# EAGLE design midipal-v01 (EAGLE 5.09)
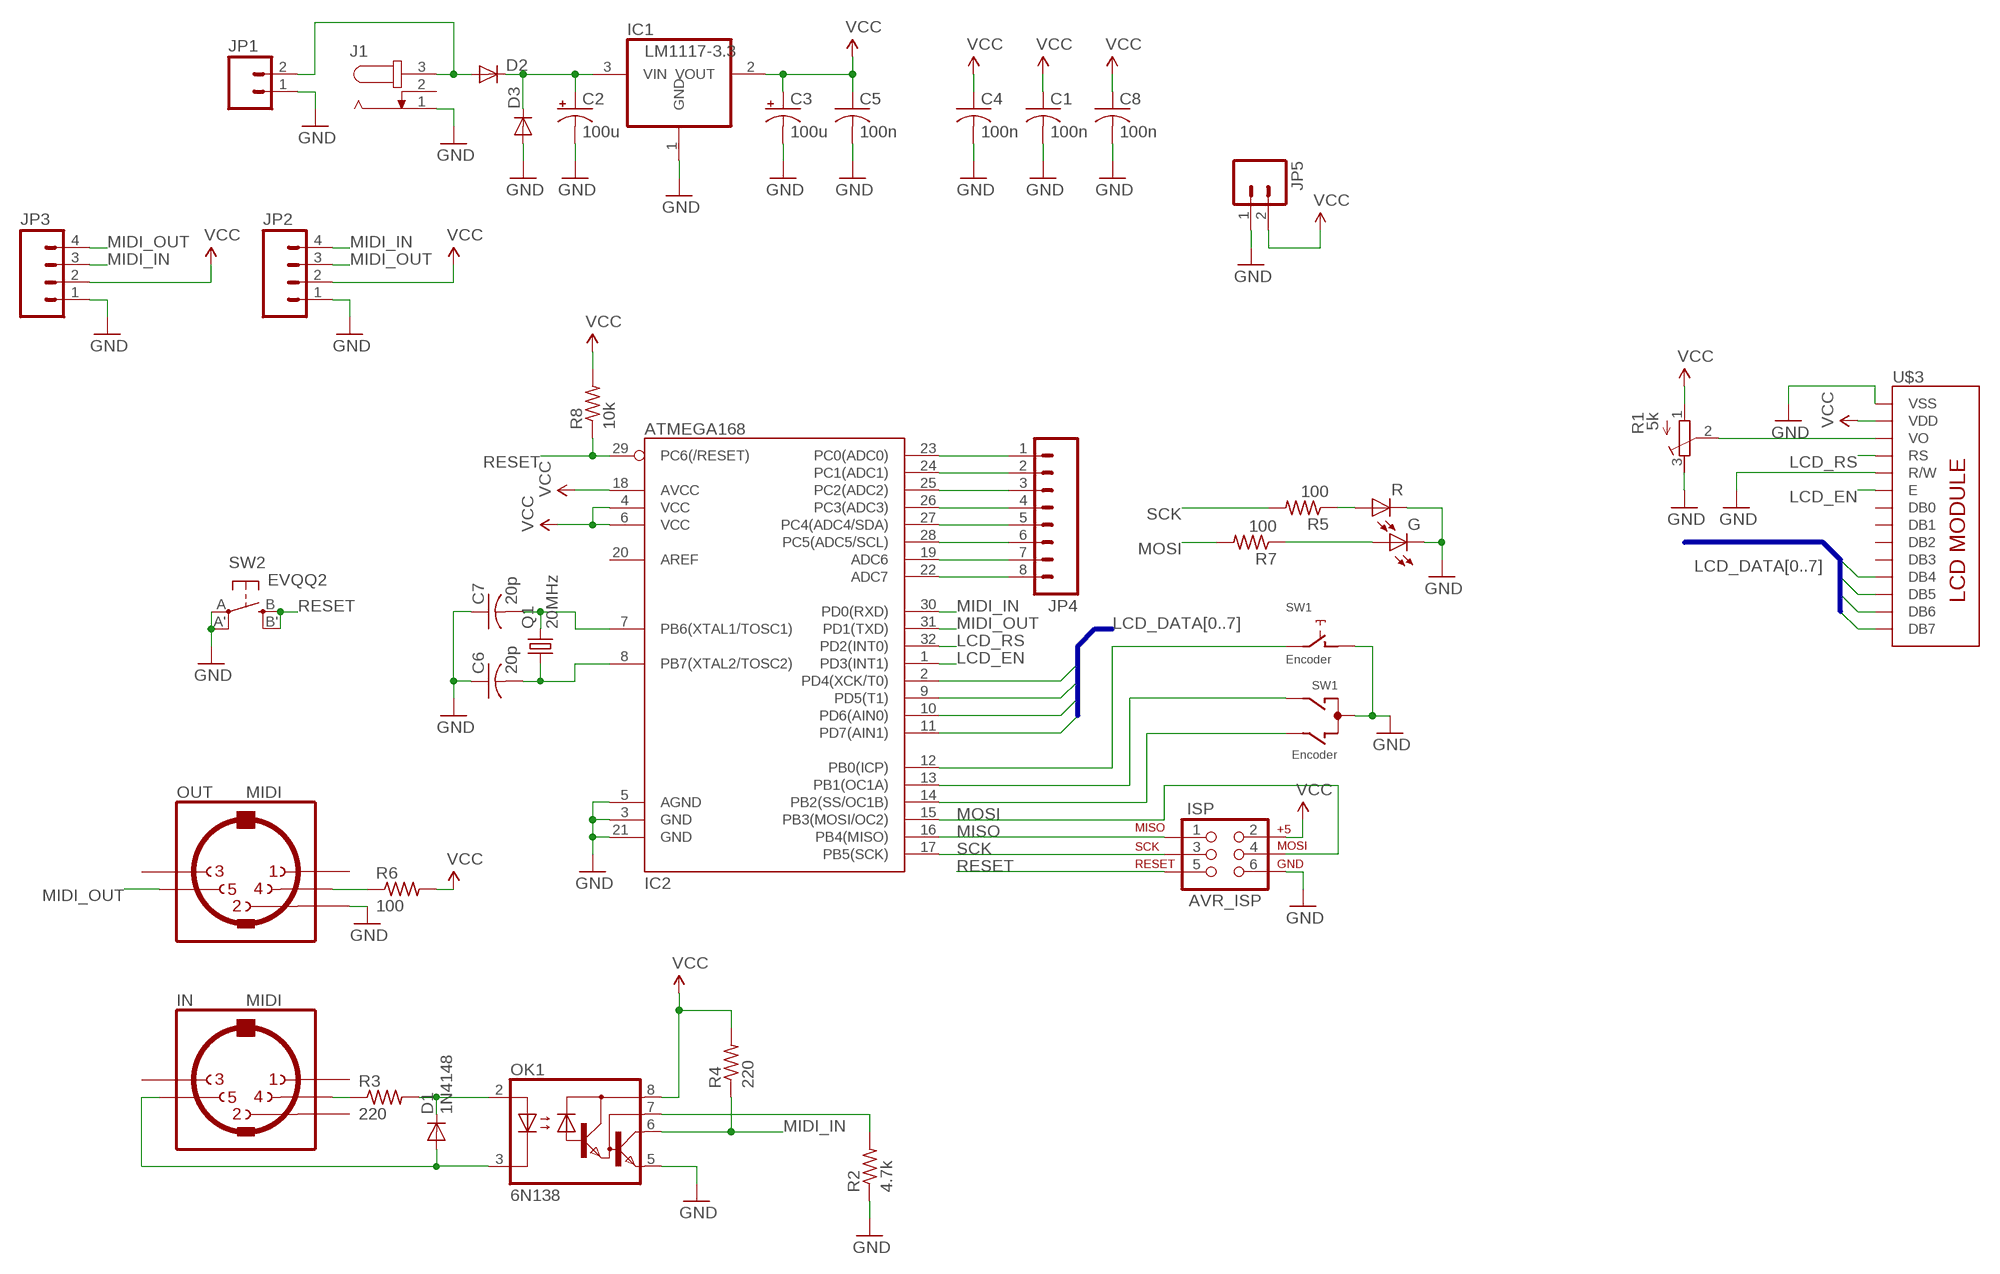
[diagram p0: schematic, sheet 1]

## Parts
C1  100n  C-USC0805  [C0805]
C2  100u  CPOL-USD  [PANASONIC_D]
C3  100u  CPOL-USD  [PANASONIC_D]
C4  100n  C-USC0805  [C0805]
C5  100n  C-USC0805  [C0805]
C6  20p  C-USC0805  [C0805]
C7  20p  C-USC0805  [C0805]
C8  100n  C-USC0805  [C0805]
D1  1N4148  DIODE-SOD323-W  [SOD323-W]
D2  DIODESMB  [SMB-DIODE]
D3  DIODESMB  [SMB-DIODE]
G  LEDCHIPLED_1206  [CHIPLED_1206]
IC1  LM1117-3.3  REG1117  [SOT223]
IC2  ATMEGA168  [TQFP32-08]
IN  MIDI  MAB5SH  [MAB5SH]
ISP  AVR_ISP  AVR_SPI_PRG_6PTH  [2X3]
J1  JACK-PLUG2  [SPC4078_BIG_HOLES]
JP1  M02  [1X02_LONGPADS]
JP2  M04PTH  [1X04]
JP3  M04PTH  [1X04]
JP4  M08  [1X08]
JP5  M02PTH  [1X02]
OK1  6N138  6N138SMD8  [DIL8-SMD]
OUT  MIDI  MAB5SH  [MAB5SH]
Q1  20MHz  CRYSTALHC49UP  [HC49UP]
R  LEDCHIPLED_1206  [CHIPLED_1206]
R1  5k  R-TRIMM3296P  [RTRIM3296P]
R2  4.7k  R-US_M0805  [M0805]
R3  220  R-US_M0805  [M0805]
R4  220  R-US_R0805  [R0805]
R5  100  R-US_R0805  [R0805]
R6  100  R-US_R0805  [R0805]
R7  100  R-US_R0805  [R0805]
R8  10k  R-US_R0805  [R0805]
SW1  Encoder  EC12E_SW  [ALPS_EC12E_SW]
SW2  EVQQ2  [EVQ-Q2]
U$3  LCD_MODULE_NO_BKL  [LCD_MODULE_1X8]

## Nets
GND: C1.2 C2.- C3.- C4.2 C5.2 C6.1 C7.1 C8.2 D3.A G.C IC1.1(GND) IC2.3(GND) IC2.5(AGND) IC2.21(GND) ISP.6 J1.1 JP1.1 JP2.1 JP3.1 JP5.1 OK1.5(GND) OUT.2 R1.3(A) R2.1 R.C SW1.C SW1.D SW2.A'(P1) SW2.A(P) U$3.1(VSS) U$3.5(R/W)
LCD_DATA4: IC2.2(PD4(XCK/T0)) U$3.11(DB4)
LCD_DATA5: IC2.9(PD5(T1)) U$3.12(DB5)
LCD_DATA6: IC2.10(PD6(AIN0)) U$3.13(DB6)
LCD_DATA7: IC2.11(PD7(AIN1)) U$3.14(DB7)
LCD_EN: IC2.1(PD3(INT1)) U$3.6(E)
LCD_RS: IC2.32(PD2(INT0)) U$3.4(RS)
MIDI_IN: IC2.30(PD0(RXD)) JP2.4 JP3.3 OK1.6(VO) R4.1
MIDI_OUT: IC2.31(PD1(TXD)) JP2.3 JP3.4 OUT.5
MISO: IC2.16(PB4(MISO)) ISP.1
MOSI: IC2.15(PB3(MOSI/OC2)) ISP.4 R7.2
N$2: C2.+ D2.C D3.C IC1.3(VIN)
N$3: IC2.23(PC0(ADC0)) JP4.1
N$5: IC2.24(PC1(ADC1)) JP4.2
N$6: IC2.25(PC2(ADC2)) JP4.3
N$7: IC2.26(PC3(ADC3)) JP4.4
N$8: IC2.27(PC4(ADC4/SDA)) JP4.5
N$9: IC2.28(PC5(ADC5/SCL)) JP4.6
N$10: IC2.19(ADC6) JP4.7
N$11: IC2.22(ADC7) JP4.8
N$12: G.A R7.1
N$13: OK1.7(VB) R2.2
N$14: R5.1 R.A
N$15: IC2.14(PB2(SS/OC1B)) SW1.B
N$16: IC2.13(PB1(OC1A)) SW1.A
N$17: IC2.12(PB0(ICP)) SW1.E
N$18: R1.2(S) U$3.3(VO)
N$28: D1.C OK1.2(A) R3.2
N$68: OUT.4 R6.1
N$72: IN.4 R3.1
N$73: D1.A IN.5 OK1.3(C)
N$82: C6.2 IC2.8(PB7(XTAL2/TOSC2)) Q1.1
N$83: C7.2 IC2.7(PB6(XTAL1/TOSC1)) Q1.2
RESET: IC2.29(PC6(/RESET)) ISP.5 R8.1 SW2.B'(S1) SW2.B(S)
SCK: IC2.17(PB5(SCK)) ISP.3 R5.2
VCC: C1.1 C3.+ C4.1 C5.1 C8.1 IC1.2(VOUT) IC2.4(VCC) IC2.6(VCC) IC2.18(AVCC) ISP.2 JP2.2 JP3.2 JP5.2 OK1.8(VCC) R1.1(E) R4.2 R6.2 R8.2 U$3.2(VDD)
VIN: D2.A J1.3 JP1.2
Unconnected: IC2.20(AREF) IN.1 IN.2 IN.3 J1.2 OUT.1 OUT.3 SW1.GND1(G) SW1.GND2(G) U$3.7(DB0) U$3.8(DB1) U$3.9(DB2) U$3.10(DB3)

## Buses
LCD_DATA[0..7]

## Library data of the parts
C1 C4-C8 = rcl:C-US: CAPACITOR, American symbol
C2 C3 = rcl:CPOL-US: POLARIZED CAPACITOR, American symbol
D1 = diode:DIODE-: DIODE
D2 D3 = SparkFun:DIODE: Diode These are standard reverse protection diodes and small signal diodes. SMA package can handle up to about 1A. SOD-323 can handle about 200mA. What the SOD-323 package when ordering, there are some mfgs out there that are 5-pin packages.
G R = led:LED: LED OSRAM: - CHIPLED LG R971, LG N971, LY N971, LG Q971, LY Q971, LO R971, LY R971 LH N974, LH R974 LS Q976, LO Q976, LY Q976 LO Q996 - Hyper CHIPLED LW Q18S LB Q993, LB Q99A, LB R99A - SideLED LS A670, LO A670, LY A670, LG A670, LP A670 LB A673, LV A673, LT A673, LW A673 LH A674 LY A675 LS A676, LA A676, LO A676, LY A676, LW A676 LS A679, LY A679, LG A679 - Hyper Micro SIDELED® LS Y876, LA Y876, LO Y876, LY Y876 LT Y87S - SmartLED LW L88C, LW L88S LB L89C, LB L89S, LG L890 LS L89K, LO L89K, LY L89K LS L896, LA L896, LO L896, LY L896 - TOPLED LS T670, LO T670, LY T670, LG T670, LP T670 LSG T670, LSP T670, LSY T670, LOP T670, LYG T670 LG T671, LOG T671, LSG T671 LB T673, LV T673, LT T673, LW T673 LH T674 LS T676, LA T676, LO T676, LY T676, LB T676, LH T676, LSB T676, LW T676 LB T67C, LV T67C, LT T67C, LS T67K, LO T67K, LY T67K, LW E67C LS E67B, LA E67B, LO E67B, LY E67B, LB E67C, LV E67C, LT E67C LW T67C LS T679, LY T679, LG T679 LS T770, LO T770, LY T770, LG T770, LP T770 LB T773, LV T773, LT T773, LW T773 LH T774 LS E675, LA E675, LY E675, LS T675 LS T776, LA T776, LO T776, LY T776, LB T776 LHGB T686 LT T68C, LB T68C - Hyper Mini TOPLED® LB M676 - Mini TOPLED Santana® LG M470 LS M47K, LO M47K, LY M47K Source: http://www.osram.convergy.de LUXEON: - LUMILED® LXK2-PW12-R00, LXK2-PW12-S00, LXK2-PW14-U00, LXK2-PW14-V00 LXK2-PM12-R00, LXK2-PM12-S00, LXK2-PM14-U00 LXK2-PE12-Q00, LXK2-PE12-R00, LXK2-PE12-S00, LXK2-PE14-T00, LXK2-PE14-U00 LXK2-PB12-K00, LXK2-PB12-L00, LXK2-PB12-M00, LXK2-PB14-N00, LXK2-PB14-P00, LXK2-PB14-Q00 LXK2-PR12-L00, LXK2-PR12-M00, LXK2-PR14-Q00, LXK2-PR14-R00 LXK2-PD12-Q00, LXK2-PD12-R00, LXK2-PD12-S00 LXK2-PH12-R00, LXK2-PH12-S00 LXK2-PL12-P00, LXK2-PL12-Q00, LXK2-PL12-R00 Source: www.luxeon.com KINGBRIGHT: KA-3528ASYC Source: www.kingbright.com
IC1 = burr-brown:REG1117: 800mA and 1A Low Dropout (LDO) Positive Regulator 1.8V, 2.5V, 2.85V, 3.3V, 5V, and Adj
IC2 = SparkFun:ATMEGA168
IN OUT = og-midi:MAB5SH: Female CONNECTOR 5 pins 90 deg. with shield, horizontal (DIN 41524)
ISP = SparkFun:AVR_SPI_PRG_6: AVR ISP 6 Pin This is the reduced ISP connector for AVR programming. Common on Arduino. This footprint will take up less PCB space and can be used with a 10-pin to 6-pin adapter such as SKU: BOB-08508
J1 = con-jack2:JACK-PLUG: DC POWER JACK Power Jack, DC, Right Angle, Through Hole, Rated 5A at 16VDC, PC Terminals Distributor: Farnell (www.Farnell.de) Drawing: 84N1161.pdf / 84N1162.pdf Manufacturer: SPC Technology (www.spctechnology.com) Type: SPC4077 / SPC 4078
JP1 JP5 = SparkFun:M02: Header 2 Standard 2-pin 0.1" header. Use with straight break away headers (SKU : PRT-00116), right angle break away headers (PRT-00553), swiss pins (PRT-00743), machine pins (PRT-00117), and female headers (PRT-00115). Molex polarized connector foot print use with SKU : PRT-08233 with associated crimp pins and housings.
JP2 JP3 = SparkFun:M04: Header 4 Standard 4-pin 0.1" header. Use with straight break away headers (SKU : PRT-00116), right angle break away headers (PRT-00553), swiss pins (PRT-00743), machine pins (PRT-00117), and female headers (PRT-00115). Molex polarized connector foot print use with SKU : PRT-08231 with associated crimp pins and housings.
JP4 = SparkFun:M08: Header 8 Standard 8-pin 0.1" header. Use with straight break away headers (SKU : PRT-00116), right angle break away headers (PRT-00553), swiss pins (PRT-00743), machine pins (PRT-00117), and female headers (PRT-00115).
OK1 = og-optocouplers:6N138: MOTOROLA OPTO COUPLER
Q1 = crystal:CRYSTAL: CRYSTAL
R1 = rcl:R-TRIMM: Trimm resistor
R2-R8 = rcl:R-US_: RESISTOR, American symbol
SW1 = switch-alps:EC12E_SW: ALPS rotary Encoder EC12E series with switch
SW2 = adafruit:EVQQ2: SMT 6mm switch, EVQQ2 series http://www.ladyada.net/library/eagle
U$3 = og-lcd:LCD_MODULE_NO_BKL

## Board
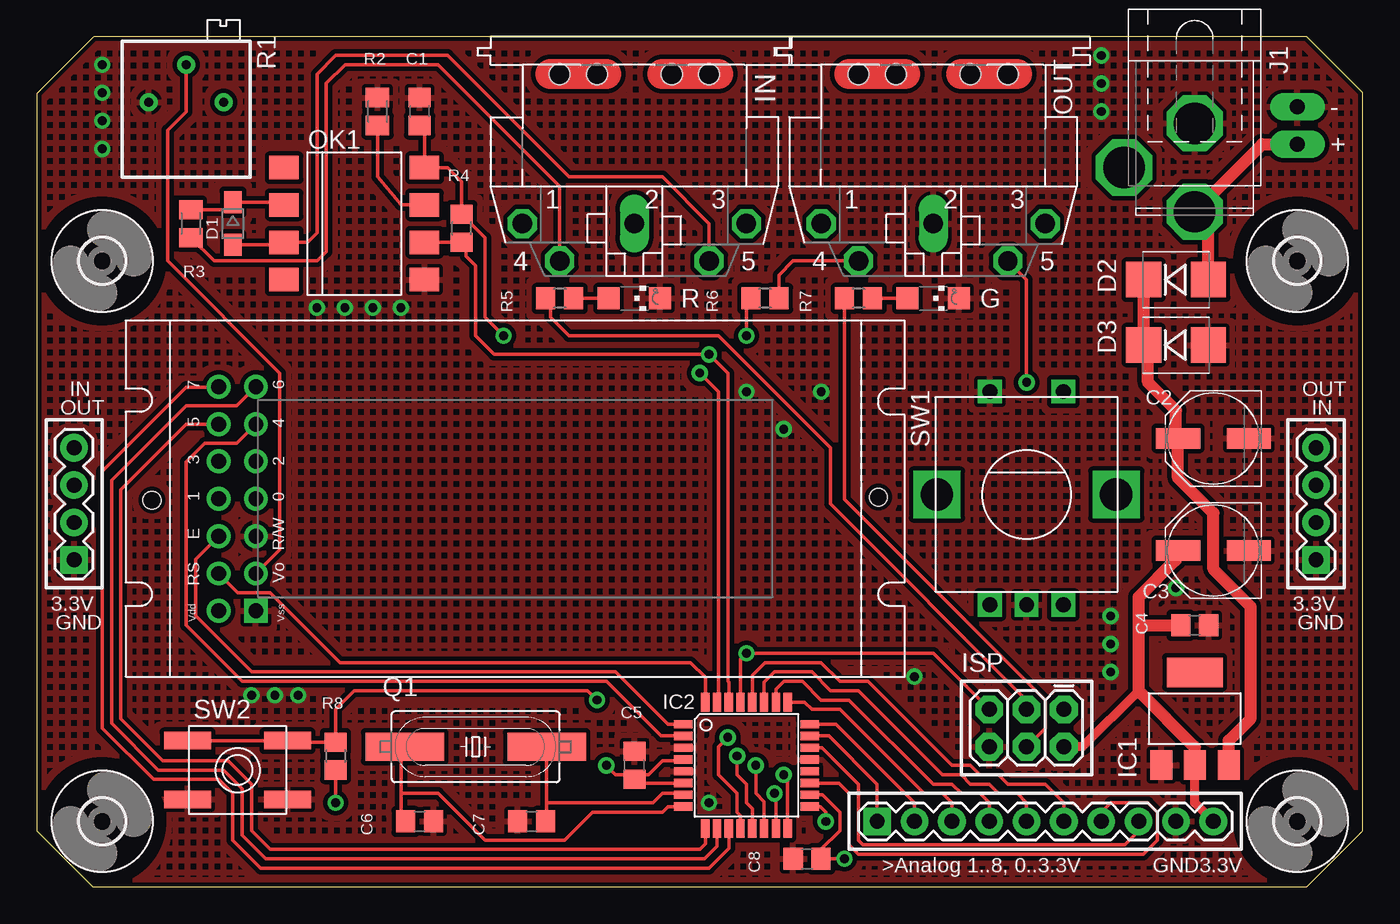
[diagram p1: board, top side]
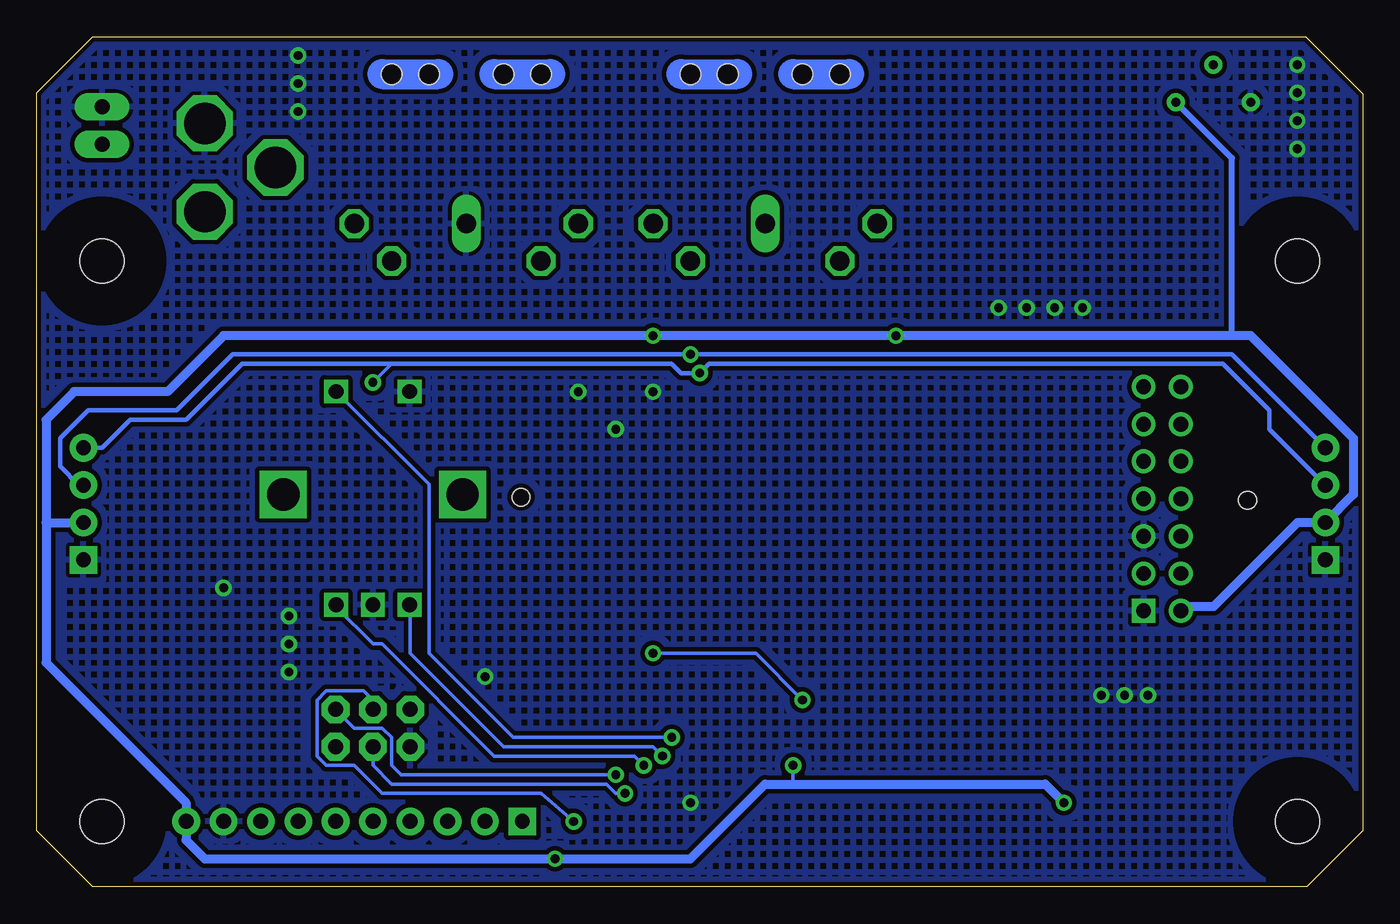
[diagram p2: board, bottom side, seen from below]

Size 90.17 x 57.79 mm. Coordinates in mm from the lower left corner, seen from the top.
Outline: 90.17,53.98 86.36,57.79 3.89,57.79 0,53.9 0,3.81 3.81,0 86.36,0 90.17,3.81 90.17,53.98
Copper layers (1*16): Top 0.035mm / dielectric 1.5mm / Bottom 0.035mm
Design rules "SparkFun": minimum track width 8mil, minimum drill 20mil, track to track 8mil, track to pad 8mil, pad to pad 8mil, via to via 8mil, smd to smd 8mil, copper to edge 10mil, drill to drill 8mil, minimum pad ring 12mil, minimum via ring 10mil, stop-mask expansion 4mil, vias tented up to drill 25mil, thermal gap 10mil

### Footprints (pad centres in the part's own frame; a part is rotated, then mirrored left to right if it is on the bottom)
C0805 = smd 1.3 x 1.5: 1 -0.95,0; 2 0.95,0
PANASONIC_D = smd 3 x 1.4: + 2.4,0; - -2.4,0
SOD323-W = smd 1.5 x 1.2: A 1.45,0; C -1.45,0
SMB-DIODE = smd 2.4 x 2.4: A 2.2,0; C -2.2,0
CHIPLED_1206 = smd 1.5 x 1.5: A 0,-1.75; C 0,1.75
SOT223 = smd 1.499 x 2.007: 1 -2.261,-3.15; 2 0.025,-3.15; 3 2.311,-3.15 | smd 3.81 x 2.007: 4 0,3.15
TQFP32-08 = smd 1.27 x 0.559: 1 -4.293,2.8; 2 -4.293,2; 3 -4.293,1.2; 4 -4.293,0.4; 5 -4.293,-0.4; 6 -4.293,-1.2; 7 -4.293,-2; 8 -4.293,-2.8; 17 4.293,-2.8; 18 4.293,-2; 19 4.293,-1.2; 20 4.293,-0.4; 21 4.293,0.4; 22 4.293,1.2; 23 4.293,2; 24 4.293,2.8 | smd 0.559 x 1.27: 9 -2.8,-4.293; 10 -2,-4.293; 11 -1.2,-4.293; 12 -0.4,-4.293; 13 0.4,-4.293; 14 1.2,-4.293; 15 2,-4.293; 16 2.8,-4.293; 25 2.8,4.293; 26 2,4.293; 27 1.2,4.293; 28 0.4,4.293; 29 -0.4,4.293; 30 -1.2,4.293; 31 -2,4.293; 32 -2.8,4.293
MAB5SH = drill 1.321 octagon: 1 7.62,7.62; 3 -7.62,7.62; 4 5.08,10.16; 5 -5.08,10.16 | drill 1.321 long: 2 0,7.62 | hole 1.4: 2.54,-2.54; -2.54,-2.54; -5.08,-2.54; 5.08,-2.54
2X3 = drill 1.016 pad 1.88 octagon: 1 0,0; 2 0,2.54; 3 2.54,0; 4 2.54,2.54; 5 5.08,0; 6 5.08,2.54
SPC4078_BIG_HOLES = drill 2.8 pad 3.81 octagon: 1 -0.46,0; 2 2.54,-4.8; 3 5.54,0
1X02_LONGPADS = drill 1.016 pad 1.88 long: 1 0,0; 2 2.54,0
1X04 = drill 1.016 pad 1.88 square: 1 0,0 | drill 1.016 pad 1.88 round: 2 2.54,0; 3 5.08,0; 4 7.62,0
1X08 = drill 1.016 pad 1.88 square: 1 0,0 | drill 1.016 pad 1.88 round: 2 2.54,0; 3 5.08,0; 4 7.62,0; 5 10.16,0; 6 12.7,0; 7 15.24,0; 8 17.78,0
1X02 = drill 1.016 pad 1.88 round: 1 0,0; 2 2.54,0
DIL8-SMD = smd 1.6 x 2: 1 -3.81,-4.77; 2 -1.27,-4.77; 3 1.27,-4.77; 4 3.81,-4.77; 5 3.81,4.77; 6 1.27,4.77; 7 -1.27,4.77; 8 -3.81,4.77
HC49UP = smd 5.334 x 1.93: 1 -4.826,0; 2 4.826,0
RTRIM3296P = drill 0.61 round: 1 0,-2.54; 2 2.54,0; 3 0,2.54
M0805 = smd 1.3 x 1.6: 1 -0.95,0; 2 0.95,0
R0805 = smd 1.3 x 1.5: 1 -0.95,0; 2 0.95,0
ALPS_EC12E_SW = drill 1 square: A -2.5,-7.5; B 2.5,-7.5; C 0,-7.5; D -2.5,7; E 2.5,7 | drill 2.2 square: GND1 -6.1,0; GND2 6.1,0
EVQ-Q2 = smd 3.2 x 1.2: A -3.4,-2; A' 3.4,-2; B -3.4,2; B' 3.4,2
3,0 = hole 3: 0,0
LCD_MODULE_1X8 = drill 1.016 square: 1 8.87,4.47 | drill 1.016 round: 2 6.33,4.47; 3 8.87,7.01; 4 6.33,7.01; 5 8.87,9.55; 6 6.33,9.55; 7 8.87,12.09; 8 6.33,12.09; 9 8.87,14.63; 10 6.33,14.63; 11 8.87,17.17; 12 6.33,17.17; 13 8.87,19.71; 14 6.33,19.71 | hole 1.2: 1.8,12; 51.2,12.2

### Placement (x,y rotation side)
C1  26.04,52.71 90 top
C2  80.01,30.48 180 top
C3  80.01,22.86 180 top
C4  78.74,17.78 0 top
C5  40.64,8.26 90 top
C6  26.04,4.45 180 top
C7  33.66,4.45 0 top
C8  52.39,1.91 180 top
D1  13.34,45.09 270 top
D2  77.47,41.27 0 top
D3  77.47,36.83 0 top
G  60.96,40.01 270 top
IC1  78.74,11.43 0 top
IC2  48.26,8.26 0 top
IN  40.64,52.71 180 top
ISP  69.85,12.06 180 top
J1  78.74,51.44 270 top
JP1  85.72,53.02 270 top
JP2  2.54,22.22 90 top
JP3  87,22.22 90 top
JP4  57.15,4.45 0 top
JP5  77.47,4.45 0 top
OK1  21.59,45.09 270 top
OUT  60.96,52.71 180 top
Q1  29.85,9.53 0 top
R  40.64,40.01 270 top
R1  10.16,53.34 90 top
R2  23.18,52.71 270 top
R3  10.48,45.09 90 top
R4  28.89,44.77 90 top
R5  35.56,40.01 180 top
R6  49.53,40.01 180 top
R7  55.88,40.01 180 top
R8  20.32,8.89 270 top
SW1  67.31,26.67 0 top
SW2  13.65,7.94 0 top
U$1  [3,0]  4.45,42.55 0 top
U$2  [3,0]  85.72,42.55 0 top
U$3  6.03,14.29 0 top
U$4  [3,0]  4.45,4.45 0 top
U$5  [3,0]  85.72,4.45 0 top

### Tracks (layer width: path | path; a pad name or v marks a point on that pad's centre or on a via)
GND  (via drill 0.6)
  other vias: 77.47,20.32 45.72,5.71 59.69,14.29 73.03,18.41 73.03,16.51 73.03,14.61 4.45,55.88 4.45,53.98 4.45,52.07 4.45,50.16 72.39,56.52 72.39,54.61 72.39,52.71 14.61,13.02 16.19,13.02 17.78,13.02 53.34,33.66 48.26,33.66 50.8,31.11 20.96,39.37 22.86,39.37 19.05,39.37 24.77,39.37
  pour Top (isolate 0.305, hatched): -1.27,59.05 -1.27,-0.64 91.44,-0.64 91.44,59.05
  pour Bottom (isolate 0.305, hatched): -1.27,-0.64 91.44,-0.64 91.44,59.05 -1.27,59.05
LCD_DATA4
  Top 0.254: U$3.11 13.61,30.16 11.43,30.16 10.16,28.89 10.16,17.78 13.97,13.97 38.73,13.97 42.45,10.26 IC2.2
LCD_DATA5
  Top 0.254: U$3.12 12.34,31.43 10.16,31.43 5.72,26.99 5.72,11.43 8.57,8.57 13.02,8.57 14.61,6.99 14.61,3.81 15.88,2.54 45.09,2.54 45.46,2.92 IC2.9
LCD_DATA6
  Top 0.254: U$3.13 13.61,32.7 10.16,32.7 5.08,27.62 5.08,11.11 8.26,7.94 12.7,7.94 13.97,6.67 13.97,3.49 15.56,1.91 45.4,1.91 46.26,2.76 IC2.10
LCD_DATA7
  Top 0.254: U$3.14 11.7,33.97 10.16,33.97 4.45,28.26 4.45,10.79 7.94,7.3 12.38,7.3 13.34,6.35 13.34,3.17 15.24,1.27 45.72,1.27 47.06,2.61 IC2.11
LCD_EN
  Top 0.254: U$3.6 10.8,22.27 10.8,18.41 14.61,14.61 39.37,14.61 42.92,11.05 IC2.1
LCD_RS
  Top 0.254: U$3.4 13.66,20 15.88,20 20.64,15.24 44.45,15.24 45.46,14.23 IC2.32
MIDI_IN  (via drill 0.6)
  Top 0.254: OK1.6 R4.1 | R4.1 | R4.1 29.21,43.5 29.21,42.86 29.85,42.23 29.85,37.47 31.12,36.2 v45.72,36.2 46.99,34.93 46.99,13.97 47.06,13.9 IC2.30
  Bottom 0.305: JP2.4 8.89,36.2 v45.72,36.2 76.84,36.2 80.65,32.39 86.68,32.39 88.58,30.48 88.58,28.57 87.31,27.3 JP3.3
MIDI_OUT  (via drill 0.6)
  Top 0.254: IC2.31 46.36,12.64 46.36,33.66 v45.09,34.93 | v67.31,34.29 67.31,41.27 OUT.5
  Bottom 0.254: 66.04,35.56 v67.31,34.29
  Bottom 0.305: JP2.3 6.35,31.11 6.35,32.39 9.53,35.56 44.45,35.56 v45.09,34.93 46.36,34.93 46.99,35.56 66.04,35.56 76.2,35.56 80.01,31.75 83.82,31.75 85.72,29.84 JP3.4
MISO  (via drill 0.6)
  Top 0.254: v50.8,7.62 51.06,7.36 IC2.16
  Bottom 0.254: ISP.1 68.58,10.79 66.68,10.79 66.04,10.16 66.04,8.26 65.41,7.62 v50.8,7.62
MOSI  (via drill 0.6)
  Top 0.254: ISP.4 68.58,10.79 68.58,12.7 54.93,26.35 54.93,38.41 R7.2 | v50.17,6.35 50.26,6.25 IC2.15
  Bottom 0.254: ISP.4 67.31,8.26 66.04,6.99 51.44,6.99 50.8,6.35 v50.17,6.35
N$2
  Top 0.813: IC1.3 81.05,9.93 82.55,11.43 82.55,19.05 80.01,21.59 80.01,25.4 77.61,27.8 C2.+ 77.47,30.62 77.47,32.39 75.56,34.29 75.56,36.54 D3.C D2.C
N$3
  Top 0.254: JP4.1 57.15,6.99 53.88,10.26 IC2.23
N$5
  Top 0.254: JP4.2 59.69,5.71 54.35,11.05 IC2.24
N$6
  Top 0.254: JP4.3 62.23,5.71 61.59,6.35 60.33,6.35 54.61,12.06 52.7,12.06 52.22,12.55 IC2.25
N$7
  Top 0.254: JP4.4 64.77,5.71 64.14,6.35 62.87,6.35 62.23,6.99 60.96,6.99 55.25,12.7 53.34,12.7 52.07,13.97 50.8,13.97 50.26,13.43 IC2.26
N$8
  Top 0.254: JP4.5 67.31,5.71 66.68,6.35 65.41,6.35 64.77,6.99 63.5,6.99 62.87,7.62 61.59,7.62 55.88,13.34 53.98,13.34 52.7,14.61 50.17,14.61 49.46,13.9 IC2.27
N$9
  Top 0.254: JP4.6 69.85,5.71 68.58,6.99 66.04,6.99 65.41,7.62 64.14,7.62 63.5,8.26 62.23,8.26 56.52,13.97 54.61,13.97 53.34,15.24 49.53,15.24 48.66,14.37 IC2.28
N$10
  Top 0.254: JP4.7 72.39,5.08 73.03,5.71 75.56,5.71 76.2,5.08 76.2,3.17 75.25,2.22 55.88,2.22 55.25,2.86 55.25,6.35 54.54,7.06 IC2.19
N$11
  Top 0.254: JP4.8 74.93,3.81 73.98,2.86 56.2,2.86 55.88,3.17 55.88,6.99 53.41,9.46 IC2.22
N$12
  Top 0.254: R7.1 G.A
N$13
  Top 0.254: R2.2 23.18,48.26 24.77,46.36 OK1.7
N$14
  Top 0.254: R5.1 R.A
N$15  (via drill 0.6)
  Top 0.254: v48.9,8.26 48.9,6.35 49.46,5.79 IC2.14
  Bottom 0.254: SW1.B 69.85,19.21 69.85,19.05 67.31,16.51 66.68,16.51 59.06,8.89 49.53,8.89 v48.9,8.26
N$16  (via drill 0.6)
  Top 0.254: v47.62,8.89 47.62,7.62 48.26,6.99 48.26,5.71 48.66,5.32 IC2.13
  Bottom 0.254: SW1.A 64.77,18.49 64.77,15.88 58.42,9.53 48.26,9.53 v47.62,8.89
N$17  (via drill 0.6)
  Top 0.254: v46.99,10.16 46.36,9.53 46.36,7.62 47.62,6.35 47.62,5.08 47.86,4.85 IC2.12
  Bottom 0.254: SW1.E 63.5,27.36 63.5,15.88 57.79,10.16 v46.99,10.16
N$18
  Top 0.254: U$3.3 16.51,22.9 16.51,34.93 8.89,42.55 8.89,51.44 10.16,52.71 R1.2
N$28
  Top 0.254: OK1.2 16.64,46.54 D1.C 12.84,46.04 R3.2
N$68
  Top 0.254: OUT.4 51.44,42.55 50.48,41.59 R6.1
N$72
  Top 0.254: IN.4 35.56,47.62 27.31,55.88 20.96,55.88 19.69,54.61 19.69,43.18 19.05,42.55 12.07,42.55 R3.1
N$73
  Top 0.254: D1.A 16.64,43.64 OK1.3 18.42,43.82 19.05,44.45 19.05,55.25 20.32,56.52 27.94,56.52 36.2,48.26 42.55,48.26 45.72,45.09 IN.5
N$82
  Top 0.254: Q1.1 25.09,9.46 24.77,9.14 24.77,6.35 | 24.77,6.35 27.31,6.35 30.48,3.17 35.88,3.17 37.78,5.08 42.55,5.08 42.92,5.46 IC2.8 | 24.77,6.35 24.77,5.08 25.09,4.76 C6.2
N$83
  Top 0.254: C7.2 34.67,4.51 34.67,5.71 | 34.67,5.71 Q1.2 | IC2.7 43.87,6.35 42.55,6.35 41.91,5.71 34.67,5.71
RESET  (via drill 0.6)
  Top 0.254: SW2.B SW2.B' 15.88,9.84 R8.1 20.32,12.06 21.59,13.34 37.47,13.34 v38.1,12.7 | ISP.5 60.96,15.88 v48.26,15.88 47.86,15.47 IC2.29
  Bottom 0.254: v38.1,12.7 41.28,15.88 v48.26,15.88
SCK  (via drill 0.6)
  Top 0.254: R5.2 34.93,39.69 34.93,38.73 36.2,37.47 46.36,37.47 53.98,29.84 53.98,26.04 67.31,12.7 ISP.3 | v53.66,4.45 53.66,5.08 53.28,5.46 IC2.17
  Bottom 0.254: ISP.3 67.31,12.7 67.94,13.34 70.49,13.34 71.12,12.7 71.12,8.89 70.49,8.26 68.58,8.26 66.68,6.35 55.88,6.35 v53.66,4.45
VCC  (via drill 0.6)
  Top 0.254: C1.1 26.36,51.76 OK1.8 27.94,48.9 28.89,47.94 R4.2 30.48,44.13 30.48,38.73 v31.75,37.47 | R6.2 48.26,39.69 v48.26,37.47 | C5.1 40.89,7.06 IC2.6 | IC2.4 43.89,8.57 42.55,8.57 41.59,7.62 40.96,7.62 C5.1 | C5.1 40.33,7.62 39.37,7.62 v38.73,8.26 | v20.32,5.71 R8.2 | IC2.18 53.44,6.25 54.61,5.08 54.61,3.81 53.34,2.54 C8.1 v54.93,1.91
  Top 0.61: 78.74,8.26 78.74,5.71 JP5.2 | 74.93,13.34 71.12,9.53 ISP.2
  Top 0.813: 74.93,17.78 74.93,13.34 78.77,9.5 IC1.2 78.74,8.26 | 74.93,17.78 74.93,19.68 77.47,22.22 77.47,22.72 C3.+ | 74.93,17.78 C4.1
  Bottom 0.254: 38.73,6.99 v38.73,8.26
  Bottom 0.406: R1.1 8.89,49.53 8.89,37.47
  Bottom 0.61: U$3.2 12.07,19.05 10.16,19.05 4.45,24.76 JP2.2 0.64,26.67 0.64,30.48 7.62,37.47 8.89,37.47 v31.75,37.47 v48.26,37.47 77.47,37.47 81.28,33.66 87.63,33.66 89.53,31.75 89.53,24.76 | 89.53,24.76 JP3.2 | v20.32,5.71 21.59,6.99 38.73,6.99 40.64,6.99 45.72,1.91 v54.93,1.91 78.74,1.91 80.01,3.17 JP5.2 80.01,5.71 89.53,15.24 89.53,24.76
VIN
  Top 0.813: D2.A 79.67,44.92 J1.3 83.33,50.48 JP1.2

### Text on the board
tNames: - | + | IN | OUT | OUT | IN | 3.3V | 3.3V | GND | GND | >Analog 1..8, 0..3.3V | GND | 3.3V